# EAGLE design scheda_cpu_nuova (EAGLE 9.6.2)
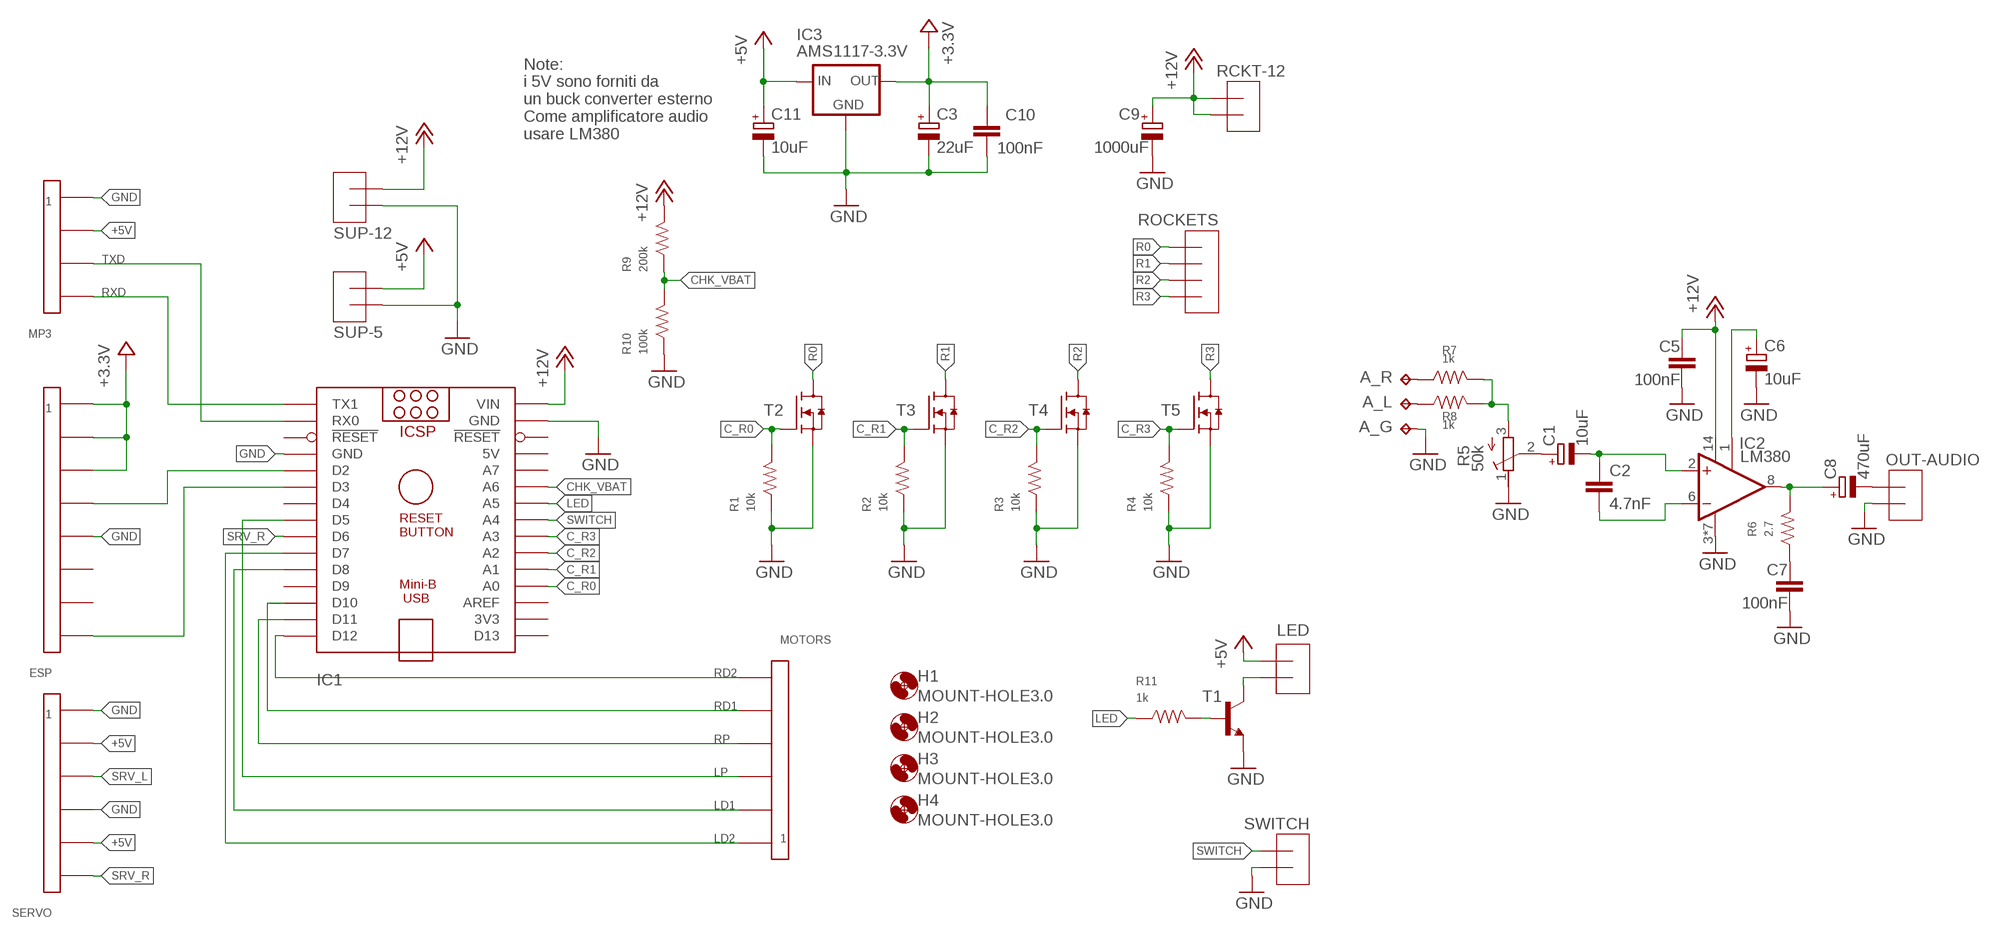
[diagram p0: schematic, sheet 1]

## Parts
A_G  TPTP15SQ  [TP15SQ]
A_L  TPTP15SQ  [TP15SQ]
A_R  TPTP15SQ  [TP15SQ]
C1  10uF  CPOL-EUE2-4  [E2-4]
C2  4.7nF  C-EUC1206  [C1206]
C3  22uF  CPOL-EUE2-4  [E2-4]
C5  100nF  C-EUC1206  [C1206]
C6  10uF  CPOL-EUE2-4  [E2-4]
C7  100nF  C-EUC1206  [C1206]
C8  470uF  CPOL-EUE3.5-8  [E3,5-8]
C9  1000uF  CPOL-EUE3.5-10  [E3,5-10]
C10  100nF  C-EUC1206  [C1206]
C11  10uF  CPOL-EUE2-4  [E2-4]
ESP  CONNECTOR-82X4-CONNECTOR  [2X4-CONNECTOR]
H1  MOUNT-HOLE3.0  [3,0]
H2  MOUNT-HOLE3.0  [3,0]
H3  MOUNT-HOLE3.0  [3,0]
H4  MOUNT-HOLE3.0  [3,0]
IC1  ARDUINO-NANO  [ARDUINO_NANO]
IC2  LM380  [DIL14]
IC3  AMS1117-3.3V  AMS1117  [SOT223]
LED  MORSETTIERE-2  [MORSETTIERE-2]
MOTORS  CONNECTOR-6  [1X6-CONNECTOR]
MP3  CONNECTOR-4  [1X4-CONNECTOR]
OUT-AUDIO  MORSETTIERE-2  [MORSETTIERE-2]
R1  10k  RESISTOR1206  [1206-RESISTOR]
R2  10k  RESISTOR1206  [1206-RESISTOR]
R3  10k  RESISTOR1206  [1206-RESISTOR]
R4  10k  RESISTOR1206  [1206-RESISTOR]
R5  50k  R-TRIMM3314J  [RTRIM3314J]
R6  2.7  RESISTOR1206  [1206-RESISTOR]
R7  1k  RESISTOR1206  [1206-RESISTOR]
R8  1k  RESISTOR1206  [1206-RESISTOR]
R9  200k  RESISTOR1206  [1206-RESISTOR]
R10  100k  RESISTOR1206  [1206-RESISTOR]
R11  1k  RESISTOR1206  [1206-RESISTOR]
RCKT-12  MORSETTIERE-2  [MORSETTIERE-2]
ROCKETS  MORSETTIERE-4  [MORSETTIERE-4]
SERVO  CONNECTOR-6  [1X6-CONNECTOR]
SUP-5  MORSETTIERE-2  [MORSETTIERE-2]
SUP-12  MORSETTIERE-2  [MORSETTIERE-2]
SWITCH  MORSETTIERE-2  [MORSETTIERE-2]
T1  BC-817  [SOT-23]
T2  MCU80N03A  [D-PAK_TO252AA]
T3  MCU80N03A  [D-PAK_TO252AA]
T4  MCU80N03A  [D-PAK_TO252AA]
T5  MCU80N03A  [D-PAK_TO252AA]

## Nets
+3.3V: C3.+ C10.1 ESP.P$1 ESP.P$2 ESP.P$3 IC3.2(OUT)
+5V: C11.+ IC3.3(IN) LED.A MP3.P$2 SERVO.P$2 SERVO.P$5 SUP-5.A
+12V: C5.1 C9.+ IC1.15(VIN) IC2.14(VSS) R9.P$2 RCKT-12.A RCKT-12.B SUP-12.A
C_R0: IC1.4(A0) R1.P$2 T2.1(G)
C_R1: IC1.5(A1) R2.P$2 T3.1(G)
C_R2: IC1.6(A2) R3.P$2 T4.1(G)
C_R3: IC1.7(A3) R4.P$2 T5.1(G)
CHK_VBAT: IC1.10(A6) R9.P$1 R10.P$2
GND: A_G.TP C3.- C5.2 C6.- C7.2 C9.- C10.2 C11.- ESP.P$5 IC1.14(GND) IC1.19(GND) IC2.3(GND) IC2.4(GND) IC2.5(GND) IC2.7(GND) IC2.10(GND) IC2.11(GND) IC2.12(GND) IC3.1(GND) MP3.P$1 OUT-AUDIO.A R1.P$1 R2.P$1 R3.P$1 R4.P$1 R5.1(E) R10.P$1 SERVO.P$1 SERVO.P$4 SUP-5.B SUP-12.B SWITCH.A T1.P$1(E) T2.3(S) T3.3(S) T4.3(S) T5.3(S)
IN_AUDIO: R5.3(A) R7.P$2 R8.P$2
LD1: IC1.26(D8) MOTORS.P$2
LD2: IC1.25(D7) MOTORS.P$1
LED: IC1.9(A5) R11.P$1
LP: IC1.23(D5) MOTORS.P$3
N$1: ESP.P$8 IC1.21(D3)
N$2: LED.B T1.P$3(C)
N$3: R11.P$2 T1.P$2(B)
N$4: ESP.P$4 IC1.20(D2)
N$5: C1.+ R5.2(S)
N$6: C1.- C2.1 IC2.2(+IN)
N$7: C2.2 IC2.6(-IN)
N$8: C6.+ IC2.1(BYPASS)
N$9: C7.1 R6.P$1
N$10: C8.+ IC2.8(OUT) R6.P$2
N$11: C8.- OUT-AUDIO.B
N$18: A_R.TP R7.P$1
N$19: A_L.TP R8.P$1
R0: ROCKETS.D T2.4(D)
R1: ROCKETS.C T3.4(D)
R2: ROCKETS.B T4.4(D)
R3: ROCKETS.A T5.4(D)
RD1: IC1.28(D10) MOTORS.P$5
RD2: IC1.30(D12) MOTORS.P$6
RP: IC1.29(D11) MOTORS.P$4
RXD: IC1.16(TX1) MP3.P$4
SRV_L: SERVO.P$3
SRV_R: IC1.24(D6) SERVO.P$6
SWITCH: IC1.8(A4) SWITCH.B
TXD: IC1.17(RX0) MP3.P$3
Unconnected: ESP.P$6 ESP.P$7 IC1.1(D13) IC1.2(3V3) IC1.3(AREF) IC1.11(A7) IC1.13(!RESET) IC1.18(!RESET) IC1.22(D4) IC1.27(D9)

## Notes on the sheet
- Note: 
  i 5V sono forniti da
  un buck converter esterno
  Come amplificatore audio
  usare LM380

## Power pins joined to a net without a drawn wire
5V: IC1.12(5V)

## Library data of the parts
A_G A_L A_R = testpad:TP: Test pad
C1 C3 C6 C8 C9 C11 = ITIS:CPOL-EU: POLARIZED CAPACITOR, European symbol
C2 C5 C7 C10 = ITIS:C-EU: CAPACITOR, European symbol
ESP = roombarmato_eagle_lib:CONNECTOR-8
H1-H4 = ITIS:MOUNT-HOLE: MOUNTING HOLE with drill center marker
IC1 = roombarmato_eagle_lib:ARDUINO-NANO: Arduino Nano V3.0 Overview: The Arduino Nano is a small, complete, and breadboard-friendly board based on the ATmega328 (Arduino Nano 3.x) or ATmega168 (Arduino Nano 2.x). It has more or less the same functionality of the Arduino Duemilanove, but in a different package. It lacks only a DC power jack, and works with a Mini-B USB cable instead of a standard one. The Nano was designed and is being produced by Gravitech. Specifications: Microcontroller Atmel ATmega168 or ATmega328 Operating Voltage (logic level) 5 V Input Voltage (recommended) 7-12 V Input Voltage (limits) 6-20 V Digital I/O Pins 14 (of which 6 provide PWM output) Analog Input Pins 8 DC Current per I/O Pin 40 mA Flash Memory 16 KB (ATmega168) or 32 KB (ATmega328) of which 2 KB used by bootloader SRAM 1 KB (ATmega168) or 2 KB (ATmega328) EEPROM 512 bytes (ATmega168) or 1 KB (ATmega328) Clock Speed 16 MHz Dimensions 0.73" x 1.70" Length 45 mm Width 18 mm Weigth 5 g Power: The Arduino Nano can be powered via the Mini-B USB connection, 6-20V unregulated external power supply (pin 30), or 5V regulated external power supply (pin 27). The power source is automatically selected to the highest voltage source. Memory: The ATmega168 has 16 KB of flash memory for storing code (of which 2 KB is used for the bootloader); the ATmega328 has 32 KB, (also with 2 KB used for the bootloader). The ATmega168 has 1 KB of SRAM and 512 bytes of EEPROM (which can be read and written with the EEPROM library); the ATmega328 has 2 KB of SRAM and 1 KB of EEPROM. Input and Output: Each of the 14 digital pins on the Nano can be used as an input or output, using pinMode(), digitalWrite(), and digitalRead() functions. They operate at 5 volts. Each pin can provide or receive a maximum of 40 mA and has an internal pull-up resistor (disconnected by default) of 20-50 kOhms. In addition, some pins have specialized functions. Visit Arduino - ArduinoBoardNano <https://www.arduino.cc/en/Main/ArduinoBoardNano>
IC2 = roombarmato_eagle_lib:LM380: Low Voltage Audio Power Amplifier Source: http://cache.national.com/ds/LM/LM386.pdf
IC3 = roombarmato_eagle_lib:AMS1117: 800mA and 1A Low Dropout (LDO) Positive Regulator 1.8V, 2.5V, 2.85V, 3.3V, 5V, and Adj; MPN: REG1117; OC_FARNELL: 1097566; OC_NEWARK: 14P6981
LED OUT-AUDIO RCKT-12 SUP-5 SUP-12 SWITCH = CyberLibrary:MORSETTIERE-2
MOTORS SERVO = roombarmato_eagle_lib:CONNECTOR-6
MP3 = roombarmato_eagle_lib:CONNECTOR-4
R1-R4 R6-R11 = roombarmato_eagle_lib:RESISTOR
R5 = rcl:R-TRIMM: Trimm resistor; SPICEMODEL: X; SPICEPREFIXL: POT
ROCKETS = roombarmato_eagle_lib:MORSETTIERE-4
T1 = CiniTechLibrary:BC-817
T2-T5 = roombarmato_eagle_lib:MCU80N03A

## Board
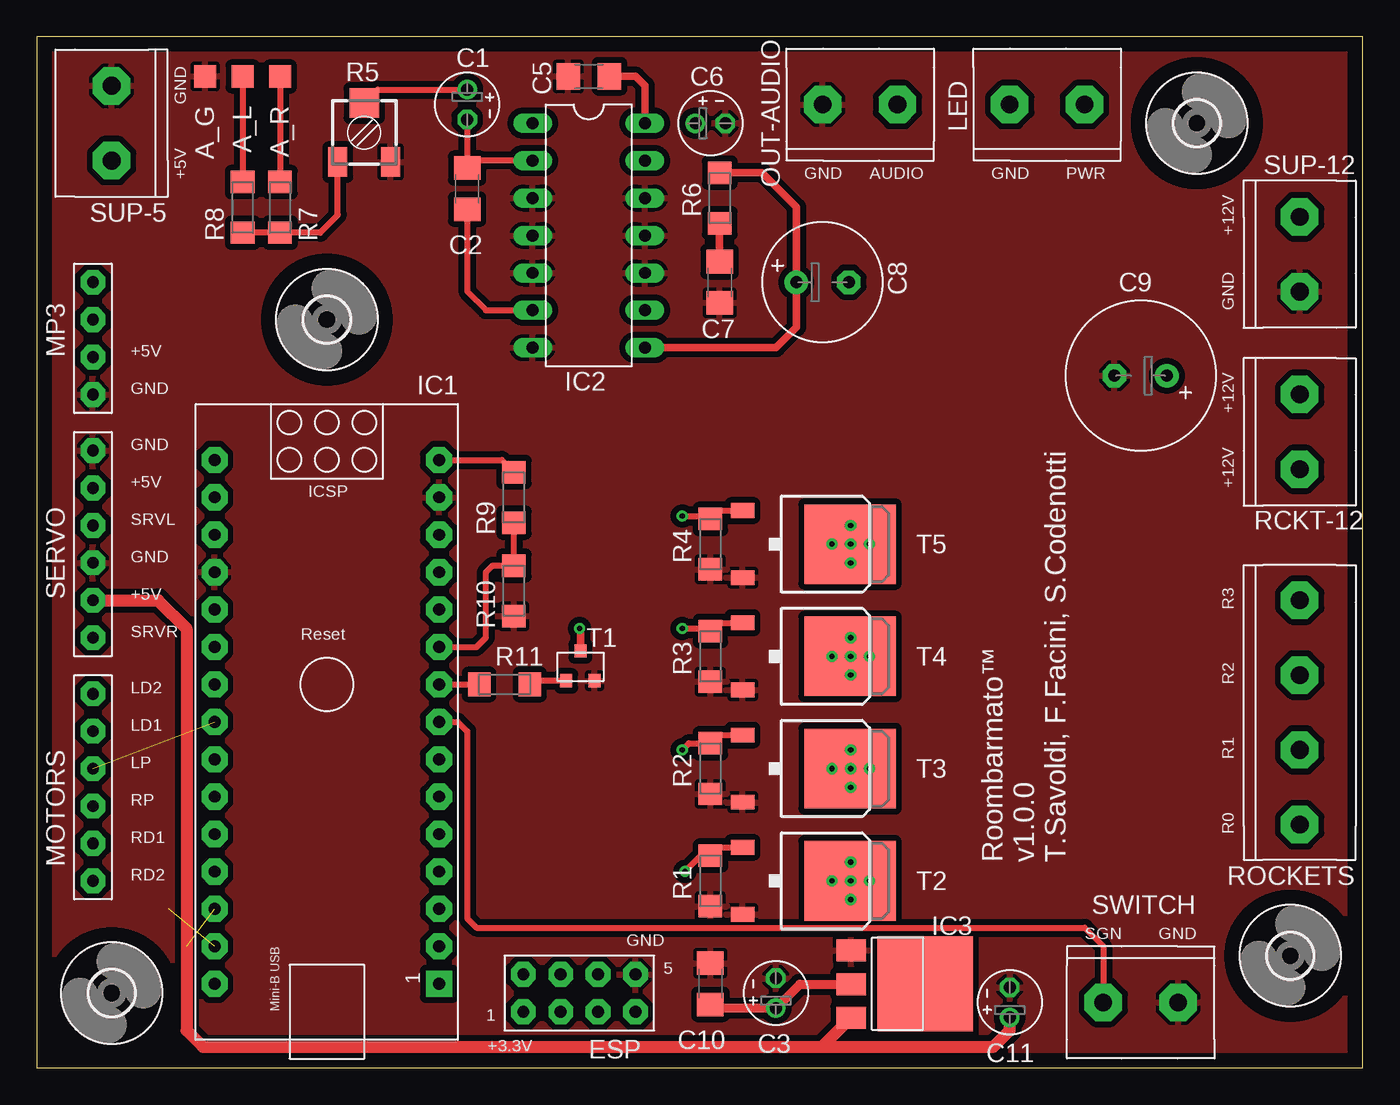
[diagram p1: board, top side]
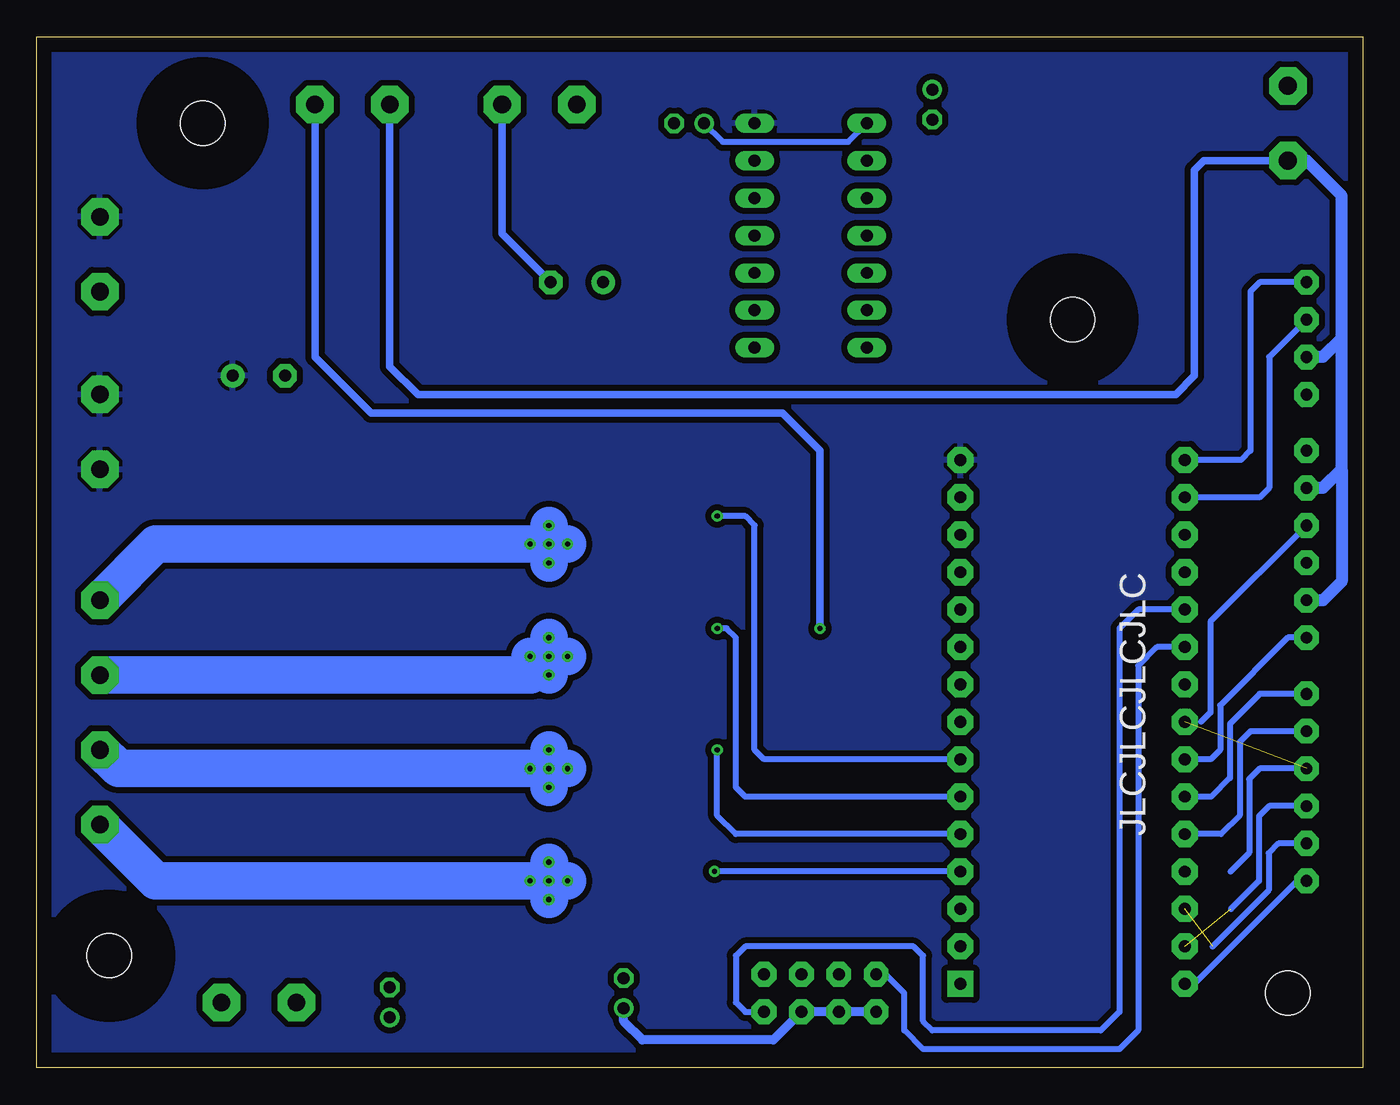
[diagram p2: board, bottom side, seen from below]

Size 90 x 70 mm. Coordinates in mm from the lower left corner, seen from the top.
Outline: 0,0 90,0 90,70 0,70 0,0
Copper layers (1*16): Top 0.035mm / dielectric 1.5mm / Bottom 0.035mm
Design rules "default": minimum track width 6mil, minimum drill 0.35mm, track to track 6mil, track to pad 6mil, pad to pad 6mil, via to via 6mil, smd to smd 6mil, copper to edge 40mil, drill to drill 6mil, minimum pad ring 10mil, minimum via ring 8mil, stop-mask expansion 4mil, vias tented up to drill 0mil, thermal gap 10mil

### Footprints (pad centres in the part's own frame; a part is rotated, then mirrored left to right if it is on the bottom)
TP15SQ = smd 1.5 x 1.5: TP 0,0
E2-4 = drill 0.813 pad 1.27: + -1.016,0 | drill 0.813 pad 1.27 octagon: - 1.016,0
C1206 = smd 1.6 x 1.8: 1 -1.4,0; 2 1.4,0
E3,5-8 = drill 0.813 pad 1.6: + -1.778,0 | drill 0.813 pad 1.6 octagon: - 1.778,0
E3,5-10 = drill 0.813 pad 1.6: + -1.778,0 | drill 0.813 pad 1.6 octagon: - 1.778,0
2X4-CONNECTOR = drill 0.8 pad 1.676 octagon: P$1 -3.81,-1.27; P$2 -1.27,-1.27; P$3 1.27,-1.27; P$4 3.81,-1.27; P$5 3.81,1.27; P$6 1.27,1.27; P$7 -1.27,1.27; P$8 -3.81,1.27
3,0 = hole 3: 0,0
ARDUINO_NANO = drill 0.8 pad 1.778 square: 1 -20.32,-7.62 | drill 0.8 pad 1.778 octagon: 2 -17.78,-7.62; 3 -15.24,-7.62; 4 -12.7,-7.62; 5 -10.16,-7.62; 6 -7.62,-7.62; 7 -5.08,-7.62; 8 -2.54,-7.62; 9 0,-7.62; 10 2.54,-7.62; 11 5.08,-7.62; 12 7.62,-7.62; 13 10.16,-7.62; 14 12.7,-7.62; 15 15.24,-7.62; 16 15.24,7.62; 17 12.7,7.62; 18 10.16,7.62; 19 7.62,7.62; 20 5.08,7.62; 21 2.54,7.62; 22 0,7.62; 23 -2.54,7.62; 24 -5.08,7.62; 25 -7.62,7.62; 26 -10.16,7.62; 27 -12.7,7.62; 28 -15.24,7.62; 29 -17.78,7.62; 30 -20.32,7.62
DIL14 = drill 0.813 long: 1 -7.62,-3.81; 2 -5.08,-3.81; 3 -2.54,-3.81; 4 0,-3.81; 5 2.54,-3.81; 6 5.08,-3.81; 7 7.62,-3.81; 8 7.62,3.81; 9 5.08,3.81; 10 2.54,3.81; 11 0,3.81; 12 -2.54,3.81; 13 -5.08,3.81; 14 -7.62,3.81
SOT223 = smd 1.499 x 2.007: 1 -2.261,-3.15; 2 0.025,-3.15; 3 2.311,-3.15 | smd 6.452 x 6.452: 4 0,1.88
MORSETTIERE-2 = drill 1.2 pad 2.54 octagon: A -2.54,0; B 2.54,0
1X6-CONNECTOR = drill 0.8 pad 1.676 octagon: P$1 -6.35,0; P$2 -3.81,0; P$3 -1.27,0; P$4 1.27,0; P$5 3.81,0; P$6 6.35,0
1X4-CONNECTOR = drill 0.8 pad 1.676 octagon: P$1 -3.81,0; P$2 -1.27,0; P$3 1.27,0; P$4 3.81,0
1206-RESISTOR = smd 1.524 x 1.6: P$1 -1.714,0; P$2 1.714,0
RTRIM3314J = smd 1.3 x 2: 1 1.8,-2; 3 -1.8,-2 | smd 2 x 2: 2 0,2
MORSETTIERE-4 = drill 1.2 pad 2.54 octagon: A -7.62,0; B -2.54,0; C 2.54,0; D 7.62,0
SOT-23 = smd 0.813 x 0.914: P$1 -1.029,1.029; P$2 0.902,1.029; P$3 -0.064,-1.003
D-PAK_TO252AA = smd 1 x 1.6: 1 -2.28,-4.8; 3 2.28,-4.8 | smd 5.4 x 6.2: 4 0,2.5

### Placement (x,y rotation side)
A_G  11.43,67.31 270 top
A_L  13.97,67.31 270 top
A_R  16.51,67.31 270 top
C1  29.21,65.41 270 top
C2  29.21,59.69 270 top
C3  50.16,5.08 90 top
C5  37.47,67.31 180 top
C6  45.72,64.14 0 top
C7  46.35,53.34 270 top
C8  53.34,53.34 0 top
C9  74.93,46.99 180 top
C10  45.72,5.71 90 top
C11  66.04,4.45 90 top
ESP  36.83,5.08 0 top
H1  5.08,5.08 0 top
H2  78.74,64.14 0 top
H3  19.68,50.8 0 top
H4  85.09,7.62 0 top
IC1  19.68,26.04 90 top
IC2  37.47,56.52 270 top
IC3  58.42,5.71 270 top
LED  68.58,65.41 0 top
MOTORS  3.81,19.05 270 top
MP3  3.81,49.53 90 top
OUT-AUDIO  55.88,65.41 0 top
R1  45.72,12.7 90 top
R2  45.72,20.32 90 top
R3  45.72,27.94 90 top
R4  45.72,35.56 90 top
R5  22.23,63.5 0 top
R6  46.35,59.05 90 top
R7  16.51,58.42 270 top
R8  13.97,58.42 270 top
R9  32.38,38.73 90 top
R10  32.38,32.38 90 top
R11  31.75,26.04 0 top
RCKT-12  85.72,43.18 270 top
ROCKETS  85.72,24.13 270 top
SERVO  3.81,35.56 270 top
SUP-5  5.08,64.14 90 top
SUP-12  85.72,55.24 270 top
SWITCH  74.93,4.45 180 top
T1  36.83,27.3 180 top
T2  52.7,12.7 270 top
T3  52.7,20.32 270 top
T4  52.7,27.94 270 top
T5  52.7,35.56 270 top

### Tracks (layer width: path | path; a pad name or v marks a point on that pad's centre or on a via)
+3.3V
  Top 0.61: IC3.2 51.79,5.69 C3.+ 45.97,4.06 C10.1
  Bottom 0.61: ESP.P$1 ESP.P$2 ESP.P$3 40.01,1.91 48.9,1.91 50.16,3.17 C3.+
+5V
  Top 0.813: SERVO.P$5 8.26,31.75 10.16,29.84 10.16,2.54 11.28,1.42 53.29,1.42 | IC3.3 53.29,1.42 | 53.29,1.42 64.92,1.42 66.04,2.54 C11.+
  Bottom 0.508: SUP-5.A 10.79,61.59 11.43,60.96 11.43,46.99 12.7,45.72 64.14,45.72 66.04,47.62 LED.A
  Bottom 0.813: 1.42,49.53 2.69,48.26 MP3.P$2 | 1.42,40.64 1.42,49.53 | 1.42,40.64 2.69,39.37 SERVO.P$2 | 1.42,40.64 1.42,33.02 2.69,31.75 SERVO.P$5 | 1.42,49.53 1.42,59.21 3.81,61.59 SUP-5.A
+12V
  Top 0.406: IC1.15 31.56,41.27 R9.P$2
  Top 0.508: C5.1 40.64,67.31 41.27,66.67 IC2.14
  pour Bottom (isolate 0.406): -5.08,95.89 -5.08,-5.08 94.61,-5.08 94.61,95.89
C_R0  (via drill 0.35)
  Top 0.406: T2.1 46.28,14.98 R1.P$2 45.09,14.41 v44.01,13.34
  Bottom 0.406: IC1.4 v44.01,13.34
C_R1  (via drill 0.35)
  Top 0.406: T3.1 46.28,22.6 R2.P$2 44.26,22.04 v43.81,21.59
  Bottom 0.406: IC1.5 42.55,15.88 43.81,17.14 v43.81,21.59
C_R2  (via drill 0.35)
  Top 0.406: T4.1 46.28,30.22 R3.P$2 45.53,29.84 v43.81,29.84
  Bottom 0.406: IC1.6 41.91,18.41 42.55,19.05 42.55,29.21 43.18,29.84 v43.81,29.84
C_R3  (via drill 0.35)
  Top 0.406: v43.81,37.47 45.53,37.47 R4.P$2 46.28,37.84 T5.1
  Bottom 0.406: IC1.7 40.64,20.95 41.27,21.59 41.27,36.83 41.91,37.47 v43.81,37.47
CHK_VBAT
  Top 0.406: R9.P$1 R10.P$2 30.92,34.1 30.48,33.66 30.48,29.21 29.84,28.57 IC1.10
GND
  pour Top (isolate 0.406): -6.99,93.98 -6.99,-5.71 94.61,-5.71 94.61,93.98
IN_AUDIO
  Top 0.406: R5.3 20.43,57.96 20.45,57.92 19.24,56.71 R7.P$2 R8.P$2
LD1
  Bottom 0.406: MOTORS.P$2 7.62,22.86 8.36,22.12 8.36,17.14 9.63,15.88 IC1.26
LD2
  Bottom 0.406: MOTORS.P$1 6.99,25.4 9.02,23.37 9.02,19.68 10.29,18.41 IC1.25
LED
  Top 0.406: IC1.9 R11.P$1
LP  (1 unrouted)
  Bottom 0.406: 8.97,13.34 7.7,14.61 7.7,19.61 6.99,20.32 MOTORS.P$3
N$1
  Bottom 0.406: IC1.21 13.97,28.57 15.24,27.3 15.24,2.54 16.51,1.27 29.84,1.27 31.11,2.54 31.11,5.08 32.38,6.35 ESP.P$8
N$2  (via drill 0.35)
  Top 0.508: v36.83,29.84 36.89,29.78 T1.P$3
  Bottom 0.508: v36.83,29.84 36.83,41.91 39.37,44.45 67.31,44.45 71.12,48.26 LED.B
N$3
  Top 0.406: T1.P$2 33.71,26.28 R11.P$2
N$4
  Bottom 0.406: IC1.20 15.24,31.11 16.51,29.84 16.51,3.81 17.78,2.54 29.21,2.54 29.84,3.17 29.84,7.62 30.48,8.26 41.91,8.26 42.55,7.62 42.55,4.45 41.91,3.81 ESP.P$4
N$5
  Top 0.406: R5.2 23.15,66.42 C1.+
N$6
  Top 0.406: C1.- 29.21,61.59 | 29.21,61.59 C2.1 | IC2.2 29.21,61.59
N$7
  Top 0.406: C2.2 29.21,52.7 30.48,51.44 IC2.6
N$8
  Bottom 0.406: IC2.1 34.92,62.87 43.43,62.87 C6.+
N$9
  Top 0.508: R6.P$1 C7.1
N$10
  Top 0.508: R6.P$2 49.21,60.77 51.56,58.42 C8.+ 51.56,50.29 50.16,48.9 IC2.8
N$11
  Bottom 0.508: C8.- 58.42,56.64 OUT-AUDIO.B
N$18
  Top 0.406: A_R.TP R7.P$1
N$19
  Top 0.406: A_L.TP R8.P$1
R0  (via drill 0.35)
  Top 2.54: T2.4 55.24,12.74 v55.24,13.97 | T2.4 v53.98,12.7 | T2.4 55.24,12.66 v55.24,11.43 | T2.4 v56.52,12.7
  Bottom 2.54: ROCKETS.D 81.92,12.7 v56.52,12.7 v55.24,12.7 | 55.2,12.74 T2.4 | v55.24,13.97 55.2,13.93 55.2,12.74 | T2.4 v53.98,12.7 v55.24,12.7 | T2.4 55.2,12.66 | v55.24,11.43 55.2,11.47 55.2,12.66 | v55.24,12.7 T2.4 | v55.24,12.7 55.2,12.74 | v55.24,12.7 55.2,12.66
R1  (via drill 0.35)
  Top 2.54: T3.4 55.2,21.59 v55.24,21.59 | T3.4 v56.52,20.32 | v55.24,19.05 55.24,20.28 T3.4 | T3.4 v53.98,20.32
  Bottom 2.54: ROCKETS.C 84.45,20.32 v56.52,20.32 v55.24,20.32 | v55.24,19.05 v55.24,20.32 | v53.98,20.32 v55.24,20.32 | v55.24,21.59 v55.24,20.32
R2  (via drill 0.35)
  Top 2.54: T4.4 55.2,29.17 v55.24,29.21 | T4.4 v56.52,27.94 | T4.4 55.24,27.9 v55.24,26.67 | T4.4 v53.98,27.94
  Bottom 2.54: T4.4 56.48,26.67 ROCKETS.B | v55.24,29.21 v55.24,27.94 | T4.4 v53.98,27.94 | v55.24,27.94 v55.24,26.67 | v55.24,27.94 v56.52,27.94 | v55.24,27.94 T4.4
R3  (via drill 0.35)
  Top 2.54: T5.4 v55.24,35.56
  Bottom 2.54: ROCKETS.A 81.92,35.56 v56.52,35.56 v55.24,35.56 | v55.24,35.56 v55.24,34.29 | v55.24,35.56 v53.98,35.56 | v55.24,35.56 v55.24,36.83
RD1  (1 unrouted)
  Bottom 0.406: MOTORS.P$5 5.71,15.24 6.38,14.58 6.38,12.06 10.19,8.26
RD2
  Bottom 0.406: IC1.30 11.43,5.71 4.45,12.7 MOTORS.P$6
RP  (1 unrouted)
  Bottom 0.406: MOTORS.P$4 6.35,17.78 7.04,17.09 7.04,12.7 8.94,10.79
RXD
  Bottom 0.406: MP3.P$4 6.99,53.34 7.62,52.7 7.62,41.91 8.26,41.27 IC1.16
SRV_L
  Bottom 0.406: SERVO.P$3 10.34,30.3 10.34,24.13 10.97,23.5
SRV_R
  Bottom 0.406: SERVO.P$6 5.08,29.21 9.68,24.61 9.68,21.59 10.31,20.95 IC1.24
SWITCH
  Top 0.406: IC1.8 28.57,23.5 29.21,22.86 29.21,10.16 29.84,9.53 71.12,9.53 72.39,8.26 SWITCH.B
TXD
  Bottom 0.406: MP3.P$3 6.35,48.26 6.35,39.37 6.99,38.73 IC1.17

### Text on the board
tNames: GND | +5V | GND | AUDIO | GND | PWR | +12V | GND | +5V | GND | +12V | GND | +5V | +12V | SRVL | GND | +5V | R3 | SRVR | R2 | LD2 | LD1 | R1 | LP | RP | R0 | RD1 | Roombarmato™ / v1.0.0 / T.Savoldi, F.Facini, S.Codenotti | RD2 | SGN | GND | GND | 5 | 1 | +3.3V
bNames: JLCJLCJLCJLC